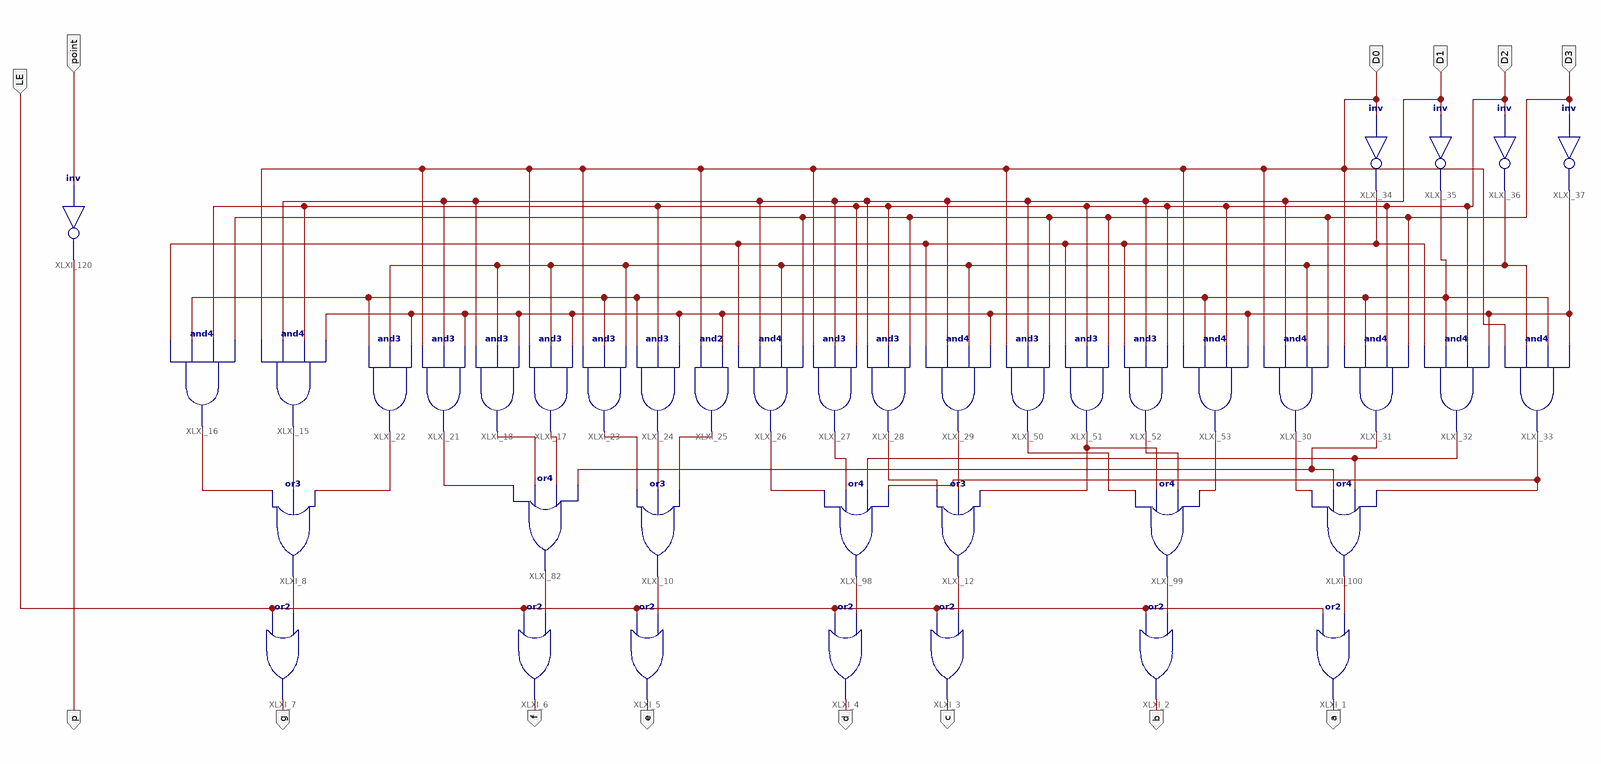
[diagram p0: schematic sheet 1]
// Xilinx ISE schematic MyMC14495.sch (kintex7) as structural Verilog: 40 symbols, 14 ports
module MyMC14495 (
  input  D2,
  input  D1,
  input  D0,
  input  D3,
  input  LE,
  input  point,
  output g,
  output f,
  output e,
  output d,
  output c,
  output b,
  output a,
  output p
);

  wire XLXN_13, XLXN_52, XLXN_53, XLXN_55, XLXN_59, XLXN_60, XLXN_61, XLXN_64, XLXN_65, XLXN_66, XLXN_67,
       XLXN_68, XLXN_83, XLXN_84, XLXN_85, XLXN_86, XLXN_87, XLXN_94, XLXN_97, XLXN_99, XLXN_100, XLXN_101,
       XLXN_102, XLXN_103, XLXN_104, XLXN_105, XLXN_125, XLXN_126, XLXN_127, XLXN_130, XLXN_131, XLXN_132;

  or XLXI_7 (g, LE, XLXN_105);
  or XLXI_8 (XLXN_105, XLXN_59, XLXN_60, XLXN_61);
  and XLXI_15 (XLXN_60, D0, D1, D2, XLXN_13);
  and XLXI_16 (XLXN_59, XLXN_55, XLXN_53, D2, D3);
  and XLXI_17 (XLXN_66, D0, XLXN_52, XLXN_13);
  and XLXI_18 (XLXN_65, D1, XLXN_52, XLXN_13);
  and XLXI_21 (XLXN_64, D0, D1, XLXN_13);
  and XLXI_22 (XLXN_61, XLXN_53, XLXN_52, XLXN_13);
  and XLXI_23 (XLXN_67, D0, XLXN_53, XLXN_52);
  and XLXI_24 (XLXN_68, XLXN_53, D2, XLXN_13);
  and XLXI_25 (XLXN_83, D0, XLXN_13);
  and XLXI_26 (XLXN_84, XLXN_55, D1, XLXN_52, D3);
  and XLXI_27 (XLXN_85, D0, D1, D2);
  and XLXI_28 (XLXN_86, D1, D2, D3);
  and XLXI_29 (XLXN_87, XLXN_55, D1, XLXN_52, XLXN_13);
  and XLXI_50 (XLXN_104, D0, D1, D3);
  and XLXI_51 (XLXN_103, XLXN_55, D2, D3);
  and XLXI_52 (XLXN_102, XLXN_55, D1, D2);
  and XLXI_53 (XLXN_101, D0, XLXN_53, D2, XLXN_13);
  and XLXI_30 (XLXN_100, D0, D1, XLXN_52, D3);
  and XLXI_31 (XLXN_94, D0, XLXN_53, D2, D3);
  and XLXI_32 (XLXN_97, XLXN_55, XLXN_53, D2, XLXN_13);
  and XLXI_33 (XLXN_99, D0, XLXN_52, XLXN_53, XLXN_13);
  not XLXI_37 (XLXN_13, D3);
  not XLXI_36 (XLXN_52, D2);
  not XLXI_35 (XLXN_53, D1);
  not XLXI_34 (XLXN_55, D0);
  or XLXI_12 (XLXN_130, XLXN_86, XLXN_87, XLXN_103);
  or XLXI_10 (XLXN_126, XLXN_67, XLXN_68, XLXN_83);
  or XLXI_82 (XLXN_125, XLXN_64, XLXN_65, XLXN_66, XLXN_94);
  or XLXI_98 (XLXN_127, XLXN_84, XLXN_85, XLXN_97, XLXN_99);
  or XLXI_99 (XLXN_131, XLXN_104, XLXN_103, XLXN_102, XLXN_101);
  or XLXI_100 (XLXN_132, XLXN_100, XLXN_94, XLXN_97, XLXN_99);
  or XLXI_6 (f, LE, XLXN_125);
  or XLXI_5 (e, LE, XLXN_126);
  or XLXI_4 (d, LE, XLXN_127);
  or XLXI_3 (c, LE, XLXN_130);
  or XLXI_2 (b, LE, XLXN_131);
  or XLXI_1 (a, LE, XLXN_132);
  not XLXI_120 (p, point);
endmodule
